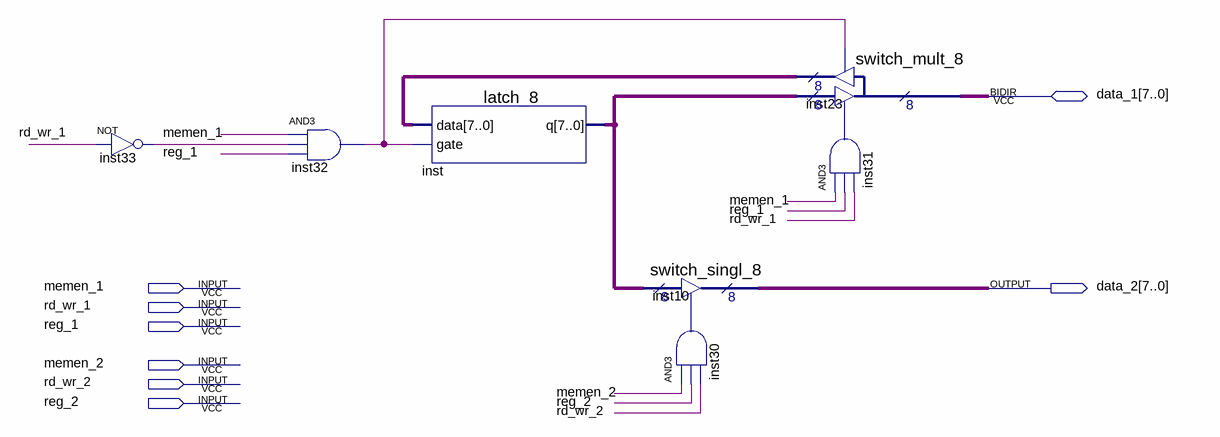
[diagram p0: schematic sheet]
// Quartus schematic gpr_item.bdf as structural Verilog: 7 symbols, 8 pins
module gpr_item (
  input  memen_1,
  input  rd_wr_1,
  input  reg_1,
  input  memen_2,
  input  rd_wr_2,
  input  reg_2,
  inout  [7:0] data_1,
  output [7:0] data_2
);

  wire inst30_out, inst31_out, inst32_out, inst33_out;
  wire [7:0] inst23_result, inst_q;

  not inst33 (inst33_out, rd_wr_1);
  and inst32 (inst32_out, memen_1, inst33_out, reg_1);
  latch_8 inst (.data(inst23_result), .gate(inst32_out), .q(inst_q));
  switch_singl_8 inst10 (.enabledt(inst30_out), .data(inst_q), .tridata(data_2));
  and inst30 (inst30_out, memen_2, reg_2, rd_wr_2);
  switch_mult_8 inst23 (
    .enabledt(inst31_out), .data(inst_q), .enabletr(inst32_out), .result(inst23_result), .tridata(data_1));
  and inst31 (inst31_out, memen_1, reg_1, rd_wr_1);
endmodule
